# EAGLE design vocore_dock (EAGLE 7.2.0)
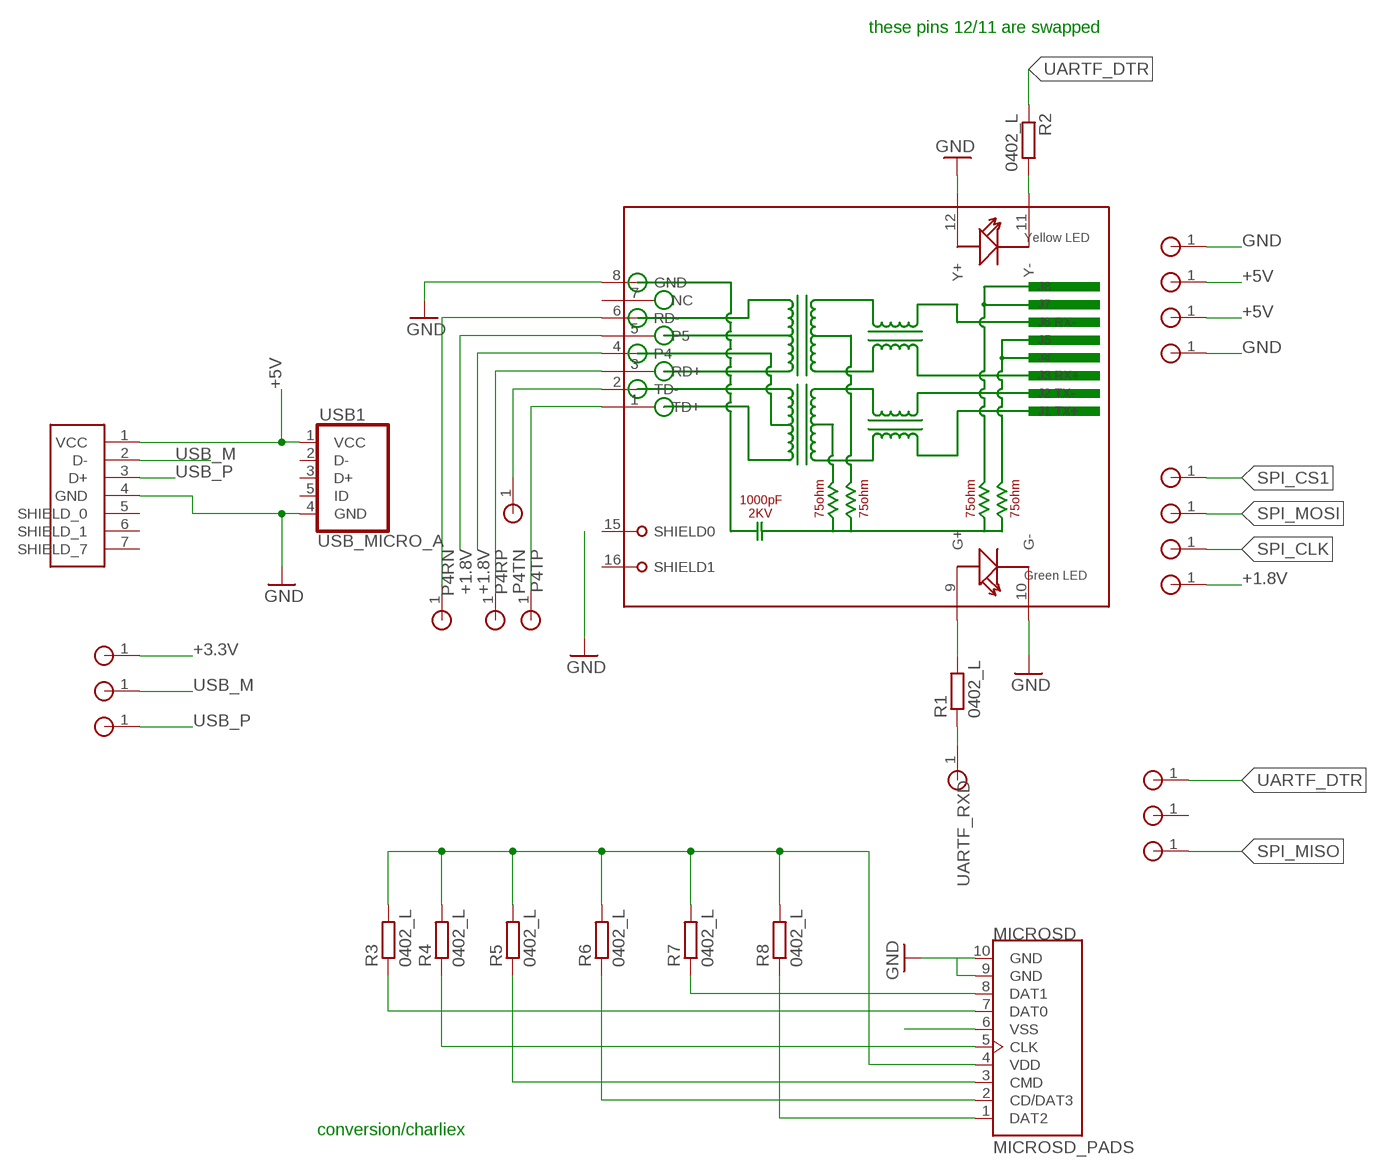
[diagram p0: schematic, sheet 1]

## Parts
MICROSD  MICROSD_PADS  [MICROSD_PADS_1PRIMARY]
PB04  PORT_1PIN  [PORT_1PIN_DECAL_1PRIMARY]
PB05  PORT_1PIN  [PORT_1PIN_DECAL_1PRIMARY]
PB06  PORT_1PIN  [PORT_1PIN_DECAL_1PRIMARY]
PB07  PORT_1PIN  [PORT_1PIN_DECAL_1PRIMARY]
PB12  PORT_1PIN  [PORT_1PIN_DECAL_1PRIMARY]
PB13  PORT_1PIN  [PORT_1PIN_DECAL_1PRIMARY]
PB14  PORT_1PIN  [PORT_1PIN_DECAL_1PRIMARY]
PB15  PORT_1PIN  [PORT_1PIN_DECAL_1PRIMARY]
PB16  PORT_1PIN  [PORT_1PIN_DECAL_1PRIMARY]
PB17  PORT_1PIN  [PORT_1PIN_DECAL_1PRIMARY]
PB18  PORT_1PIN  [PORT_1PIN_DECAL_1PRIMARY]
PL05  PORT_1PIN  [PORT_1PIN_DECAL_1PRIMARY]
PL06  PORT_1PIN  [PORT_1PIN_DECAL_1PRIMARY]
PL07  PORT_1PIN  [PORT_1PIN_DECAL_1PRIMARY]
PL08  PORT_1PIN  [PORT_1PIN_DECAL_1PRIMARY]
PT01  PORT_1PIN  [PORT_1PIN_DECAL_1PRIMARY]
PT02  PORT_1PIN  [PORT_1PIN_DECAL_1PRIMARY]
PT03  PORT_1PIN  [PORT_1PIN_DECAL_1PRIMARY]
PT04  PORT_1PIN  [PORT_1PIN_DECAL_1PRIMARY]
R1  0402_L  [0402_L_1PRIMARY]
R2  0402_L  [0402_L_1PRIMARY]
R3  0402_L  [0402_L_1PRIMARY]
R4  0402_L  [0402_L_1PRIMARY]
R5  0402_L  [0402_L_1PRIMARY]
R6  0402_L  [0402_L_1PRIMARY]
R7  0402_L  [0402_L_1PRIMARY]
R8  0402_L  [0402_L_1PRIMARY]
RJ45  RJ45ALED  HR911105AHR911105A  [RJ45ALED_1PRIMARY]
USB1  USB_MICRO_A  USB_MICRO_AUSB_MICRO_A  [USB_MICRO_A_1PRIMARY]
USB2  USB_FULL_TALL  [USB_FULL_TALL_1PRIMARY]

## Nets
+1.8V: PL05.1 RJ45.4 RJ45.5
+3.3V: MICROSD.4(VDD) PB18.1 R3.2 R4.2 R5.2 R6.2 R7.2 R8.2
+5V: PT02.1 PT03.1 USB1.1(VCC) USB2.1(VCC)
GND: MICROSD.6(VSS) MICROSD.9(GND) MICROSD.10(GND) PT01.1 PT04.1 RJ45.8(GND) RJ45.10(G-) RJ45.12(Y+) USB1.4(GND) USB2.4(GND)
LED_G: R1.2 RJ45.9(G+)
LED_Y: R2.2 RJ45.11(Y-)
P4RN: PB15.1 RJ45.6(RD-)
P4RP: PB14.1 RJ45.3(RD+)
P4TN: PB12.1 RJ45.2(TD-)
P4TP: PB13.1 RJ45.1(TD+)
SPI_CLK: MICROSD.5(CLK) PL06.1 R4.1
SPI_CS1: MICROSD.2(CD/DAT3) PL08.1 R6.1
SPI_MISO: MICROSD.7(DAT0) PB05.1 R3.1
SPI_MOSI: MICROSD.3(CMD) PL07.1 R5.1
SPI_RSV1: MICROSD.8(DAT1) R7.1
SPI_RSV2: MICROSD.1(DAT2) R8.1
UARTF_DTR: PB07.1 R2.1
UARTF_RXD: PB04.1 R1.1
USB_M: PB16.1 USB2.2(D-)
USB_P: PB17.1 USB2.3(D+)
Unconnected: PB06.1 RJ45.7(NC) RJ45.15(SHIELD0) RJ45.16(SHIELD1) USB1.2(D-) USB1.3(D+) USB1.5(ID) USB2.5(SHIELD_0) USB2.6(SHIELD_1) USB2.7(SHIELD_7)

## Notes on the sheet
- these pins 12/11 are swapped
- conversion/charliex

## Library data of the parts
MICROSD = vocore_dock:MICROSD_PADS
PB04-PB07 PB12-PB18 PL05-PL08 PT01-PT04 = vocore_dock:PORT_1PIN
R1-R8 = vocore_dock:0402_L
RJ45 = vocore_dock:HR911105A
USB1 = vocore_dock:USB_MICRO_A
USB2 = vocore_dock:USB_FULL_TALL

## Board
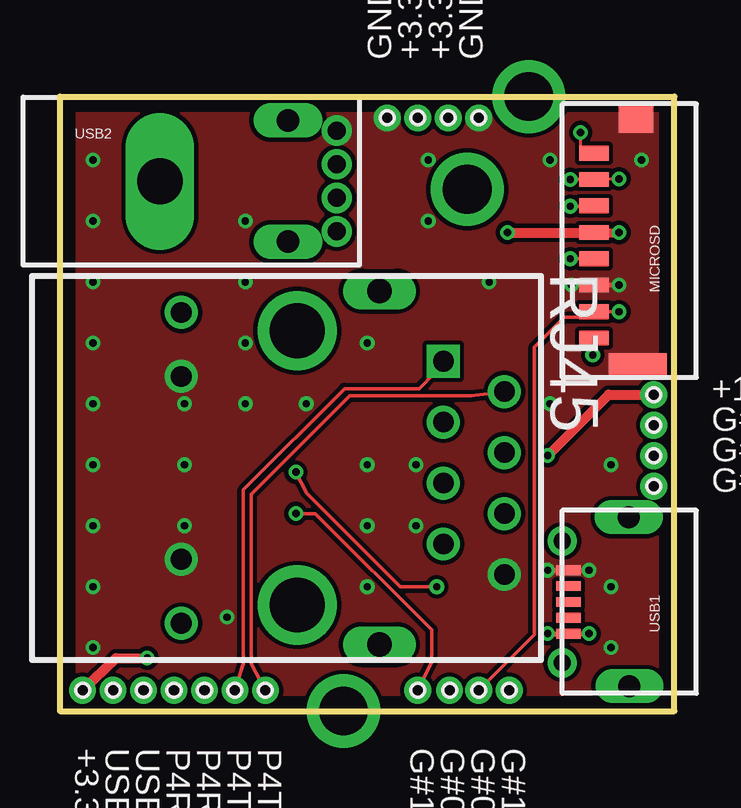
[diagram p1: board, top side]
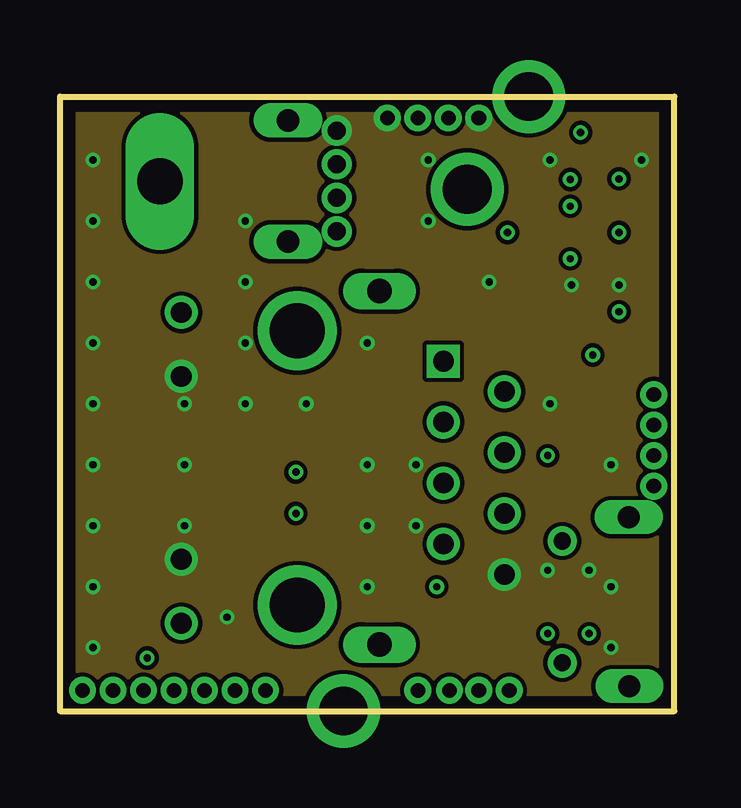
[diagram p2: board, inner layer Route2]
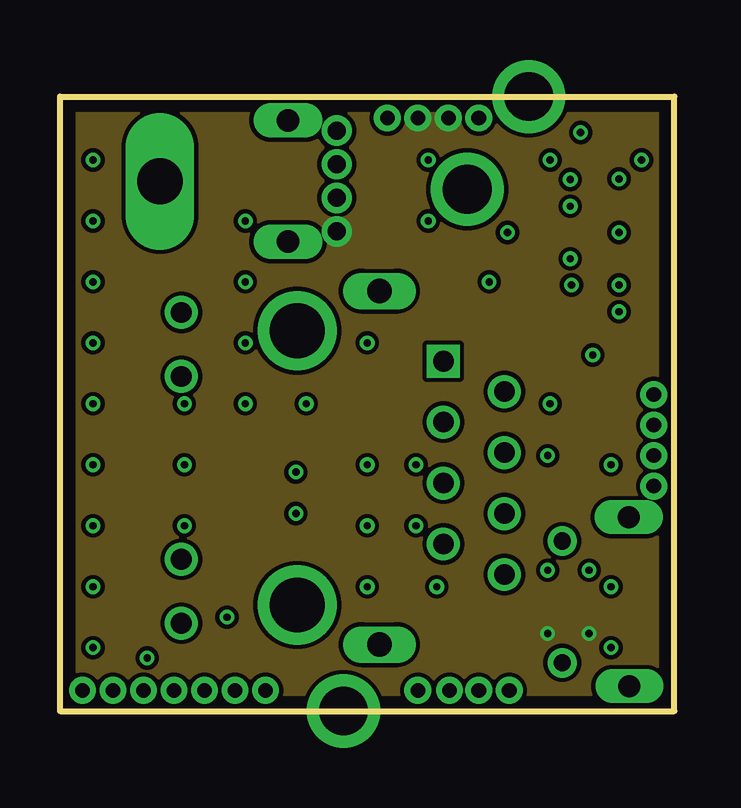
[diagram p3: board, inner layer Route3]
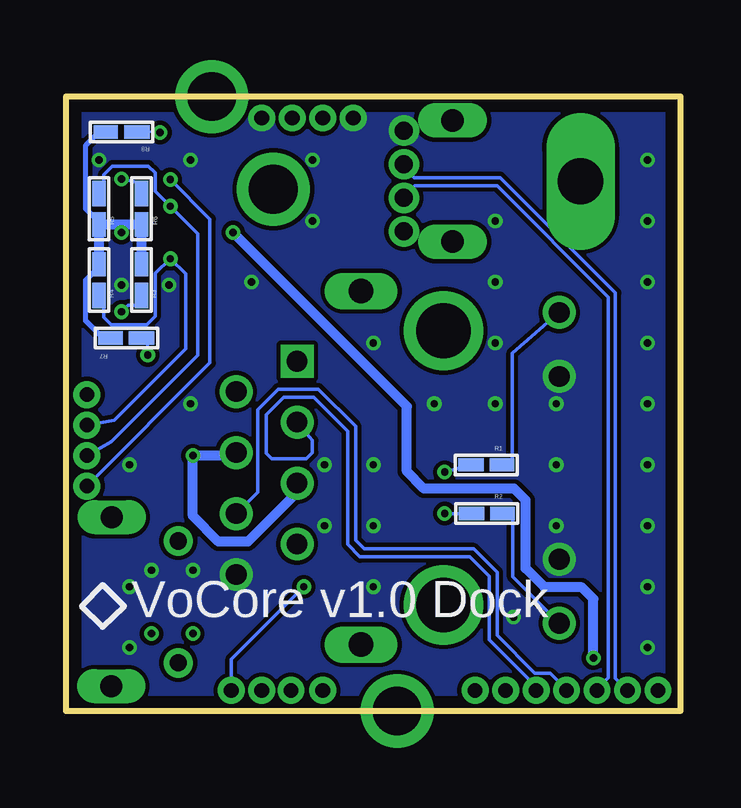
[diagram p4: board, bottom side, seen from below]

Size 25.6 x 25.6 mm. Coordinates in mm from the lower left corner, seen from the top.
Outline: 0,25.6 25.6,25.6 25.6,0 0,0 0,25.6
Copper layers ((1*2)*(3*16)): Top 0.0356mm / dielectric 1.5011mm / Route2 0.0356mm / dielectric 0.1499mm / Route3 0.0356mm / dielectric 0.2007mm / Bottom 0.0356mm
Design rules "SilverCircuits4layer *": minimum track width 4mil, minimum drill 14mil, track to track 7mil, track to pad 7mil, pad to pad 7mil, via to via 7mil, smd to smd 0mil, copper to edge 20mil, drill to drill 8mil, minimum pad ring 10mil, minimum via ring 2mil, stop-mask expansion 4mil, vias tented up to drill 0mil, thermal gap 10mil

### Footprints (pad centres in the part's own frame; a part is rotated, then mirrored left to right if it is on the bottom)
HOLE_80MIL_1PRIMARY = drill 2.032 pad 2.032: 1 0,0
MICROSD_PADS_1PRIMARY = smd 0.61 x 1.245: 1 9.347,-1.321; 2 8.255,-1.321; 3 7.163,-1.321; 4 6.045,-1.321; 5 4.953,-1.321; 6 3.861,-1.321; 7 2.743,-1.321; 8 1.651,-1.321 | smd 0.965 x 2.413: 9 0.533,-3.15 | smd 1.143 x 1.448: 10 10.77,-3.073
PORT_1PIN_DECAL_1PRIMARY = drill 0.61 pad 0.914: 1 -0.076,-1.27
0402_L_1PRIMARY = smd 0.559 x 1.067: 1 0,1.143 | smd 0.559 x 1.016: 2 0,-0.152
RJ45ALED_1PRIMARY = drill 0.864 pad 1.27 square: 1 3.556,17.145 | drill 0.864 pad 1.27: 2 4.826,19.685; 3 6.096,17.145; 4 7.366,19.685; 5 8.636,17.145; 6 9.906,19.685; 7 11.176,17.145; 8 12.446,19.685; 9 1.524,6.223; 10 4.191,6.223; 11 14.478,6.223; 12 11.811,6.223 | drill 2.286 pad 2.286: 13 13.716,11.049; 14 2.286,11.049 | drill 1.016 pad 1.372 long: 15 0.635,14.478; 16 15.367,14.478
USB_MICRO_A_1PRIMARY = smd 0.406 x 1.016: 1 2.489,-0.254; 2 3.15,-0.254; 3 3.81,-0.254; 4 5.131,-0.254; 5 4.47,-0.254 | drill 0.711 pad 1.016: 6 1.27,0; 7 6.35,0 | drill 0.914 pad 1.168 long: 8 0.305,-2.794; 9 7.341,-2.769
USB_FULL_TALL_1PRIMARY = drill 0.762 pad 1.016: 1 5.588,13.081; 2 4.191,13.081; 3 2.794,13.081; 4 1.397,13.081 | drill 0.94 pad 1.194 long: 5 0.965,11.049; 6 6.02,11.049 | drill 1.905 pad 2.286 long: 7 3.505,5.715

### Placement (x,y rotation side)
HOLE1  HOLE_80MIL  [HOLE_80MIL_1PRIMARY]  16.97,21.74 0 top
HOLE2  HOLE_80MIL  [HOLE_80MIL_1PRIMARY]  11.81,0 0 top
HOLE3  HOLE_80MIL  [HOLE_80MIL_1PRIMARY]  19.53,25.6 0 top
MICROSD  20.93,13.89 90 top
PB04  18.8,2.13 0 top
PB05  17.53,2.13 0 top
PB06  16.31,2.13 0 top
PB07  14.99,2.13 0 top
PB12  8.64,2.13 0 top
PB13  7.37,2.13 0 top
PB14  6.1,2.13 0 top
PB15  4.83,2.13 0 top
PB16  3.56,2.13 0 top
PB17  2.29,2.13 0 top
PB18  1.02,2.13 0 top
PL05  24.82,14.45 0 top
PL06  24.82,13.18 0 top
PL07  24.82,11.91 0 top
PL08  24.82,10.64 0 top
PT01  17.53,25.98 0 top
PT02  16.26,25.98 0 top
PT03  14.99,25.98 0 top
PT04  13.72,25.98 0 top
R1  7.59,10.26 90 bottom
R2  7.57,8.23 90 bottom
R3  22.45,18.47 180 bottom
R4  24.23,18.47 180 bottom
R5  24.23,20.42 0 bottom
R6  22.45,20.42 0 bottom
R7  23.6,15.54 270 bottom
R8  23.8,24.13 270 bottom
RJ45  -1.17,18.14 270 top
USB1  20.93,0.74 90 top
USB2  -1.55,25.58 270 top

### Tracks (layer width: path | path; a pad name or v marks a point on that pad's centre or on a via)
+1.8V  (via drill 0.3 pad 0.61)
  Top 0.406: v20.32,10.64 22.86,13.18 PL05.1
  Bottom 0.406: RJ45.5 15.95,9.14 18.03,7.06 19.25,7.06 20.32,8.13 v20.32,10.64 18.77,10.64 RJ45.4
+3.3V  (via drill 0.3 pad 0.61)
  Top 0.381: 22.22,19.94 MICROSD.4 v23.29,19.94
  Top 0.406: PB18.1 2.34,2.21 v3.63,2.21 | v18.64,19.94 22.22,19.94
  Bottom 0.127: v23.29,19.94 23.29,20.27
  Bottom 0.203: R8.2 24.23,24.13 24.79,23.57 24.79,20.93 24.23,20.37 R5.2 24.23,20.24 | R4.2 24.23,18.52 24.79,17.96 24.79,16.26 24.08,15.54 R7.2
  Bottom 0.406: v3.63,2.21 3.63,4.67 4.11,5.16 5.66,5.16 6.45,5.94 6.45,8.79 6.93,9.27 10.69,9.27 11.4,9.98 11.4,12.7 v18.64,19.94 | R4.2 24.23,20.24 | R3.2 R6.2 23.29,20.27 R5.2
+5V  (via drill 0.3 pad 0.61)
  Top 0.203: v22.05,3.23 USB1.1 v20.32,3.23
  pour Route3 (no thermals): 0.1,25.53 25.5,25.53 25.5,0.13 0.1,0.13
GND  (via drill 0.3 pad 0.61)
  Top 0.203: v20.32,5.87 USB1.4 v22.05,5.87 | v21.31,17.75 MICROSD.6 v23.29,17.75
  other vias: 6.96,3.91 5.18,7.72 1.37,7.72 1.37,10.26 1.37,12.8 1.37,15.34 1.37,17.88 1.37,20.42 1.37,22.96 1.37,5.18 1.37,2.64 5.18,10.26 5.18,12.8 7.72,12.8 7.72,15.34 12.8,15.34 7.72,17.88 7.72,20.42 10.26,12.8 12.8,10.26 14.83,10.26 12.8,7.72 12.8,5.18 14.83,7.72 22.96,5.18 22.96,2.64 22.96,10.26 20.42,12.8 15.34,22.96 15.34,20.42 17.88,17.88 20.42,22.96 24.23,22.96
  pour Top (no thermals): 0.1,25.5 25.5,25.5 25.5,0.1 0.1,0.1
  pour Bottom (no thermals): 0.1,25.5 25.5,25.5 25.5,0.1 0.1,0.1
  pour Route2 (no thermals): 0.1,25.5 25.5,25.5 25.5,0.1 0.1,0.1
LED_G
  Bottom 0.152: R1.2 7.01,10.26 7.01,14.91 RJ45.9
LED_Y
  Bottom 0.152: RJ45.11 6.98,5.59 6.98,8.23 R2.2
P4RN
  Bottom 0.152: PB15.1 4.75,0.89 5.44,1.57 6.07,1.57 7.65,3.15 7.65,5.79 8.61,6.76 13.18,6.76 13.54,7.11 13.54,11.86 15.09,13.41 16.76,13.41 17.63,12.55 17.63,9.12 RJ45.6
P4RP
  Bottom 0.152: PB14.1 6.02,1.02 7.98,2.97 7.98,5.61 8.79,6.43 13.36,6.43 13.87,6.96 13.87,11.66 15.29,13.08 16.54,13.08 17.27,12.34 17.27,10.74 17.04,10.52 15.6,10.52 15.34,10.77 15.34,11.28 RJ45.3
P4TN
  Top 0.152: PB12.1 7.98,1.98 7.98,9.04 12.06,13.13 17.14,13.13 RJ45.2
P4TP
  Top 0.152: RJ45.1 16.21,14.71 14.96,13.44 11.86,13.44 7.65,9.22 7.65,1.98 PB13.1
SPI_CLK  (via drill 0.3 pad 0.61)
  Top 0.152: v21.26,18.85 MICROSD.5
  Bottom 0.152: PL06.1 23.6,12.12 20.62,15.09 20.62,18.21 v21.26,18.85 21.89,18.24 21.89,16.46 22.25,16.1 23.72,16.1 24.03,16.41 24.03,17.07 24.23,17.27 R4.1
SPI_CS1  (via drill 0.3 pad 0.61)
  Top 0.152: v21.26,22.15 MICROSD.2 v23.29,22.17
  Bottom 0.152: PL08.1 19.61,14.5 19.61,20.5 v21.26,22.15 | v23.29,22.17 22.61,22.02 22.45,21.84 R6.1
SPI_MISO  (via drill 0.3 pad 0.61)
  Top 0.152: PB05.1 19.76,3.17 19.76,15.16 21.01,16.41 22.25,16.41 MICROSD.7 v23.29,16.64
  Bottom 0.152: v23.29,16.64 23.01,16.92 22.48,16.92 22.48,17.3 R3.1
SPI_MOSI  (via drill 0.3 pad 0.61)
  Top 0.152: v21.26,21.03 22.25,21.03 MICROSD.3
  Bottom 0.152: PL07.1 23.72,11.23 20.12,14.83 20.12,19.89 v21.26,21.03 21.89,21.67 21.89,22.43 22.17,22.71 23.67,22.71 24.03,22.35 24.03,21.56 R5.1
SPI_RSV1  (via drill 0.3 pad 0.61)
  Top 0.127: 22.33,15.54 MICROSD.8 22.2,15.54 v22.2,14.83
  Bottom 0.127: R7.1 22.2,15.54 v22.2,14.83
SPI_RSV2  (via drill 0.3 pad 0.61)
  Top 0.127: MICROSD.1 21.69,23.24 v21.69,24.1
  Bottom 0.127: v21.69,24.1 22.33,24.13 R8.1
UARTF_DTR  (via drill 0.3 pad 0.61)
  Top 0.152: PB07.1 15.49,2.06 15.49,3.38 10.64,8.23 v9.83,8.23
  Bottom 0.152: R2.1 v9.83,8.23
UARTF_RXD  (via drill 0.3 pad 0.61)
  Top 0.152: v15.7,5.18 14.17,5.18 10.29,9.07 v9.83,9.96
  Bottom 0.152: PB04.1 18.72,2.16 v15.7,5.18 | v9.83,9.96 8.76,10.26 R1.1
USB_M
  Bottom 0.152: PB16.1 3.48,0.94 3.02,1.4 3.02,17.25 7.65,21.89 11.07,21.89 11.53,21.44 USB2.2
USB_P
  Bottom 0.152: PB17.1 2.72,1.37 2.72,17.42 7.52,22.22 11.1,22.22 USB2.3

### Text on the board
tPlace: convert your VoCore into the tiniest router on the earth. | copyright © 2014 vonger.cn | GND | +3.3V ~ +6.0V | +3.3V ~ +6.0V | GND | +1.8V | G#04/SPI_CLK | G#05/SPI_MOSI | G#27/SPI_CS1 | +3.3V | USB+ | USB- | P4RN | P4RP | P4TP | P4TN | G#11/PCM_FS | G#03/SPI_CS0 | G#06/SPI_MISO | G#10/I2S_SDI/RXD | VoCore v1.0 Dock
bPlace: VoCore v1.0 Dock